# EAGLE design main (EAGLE 6.5.0)
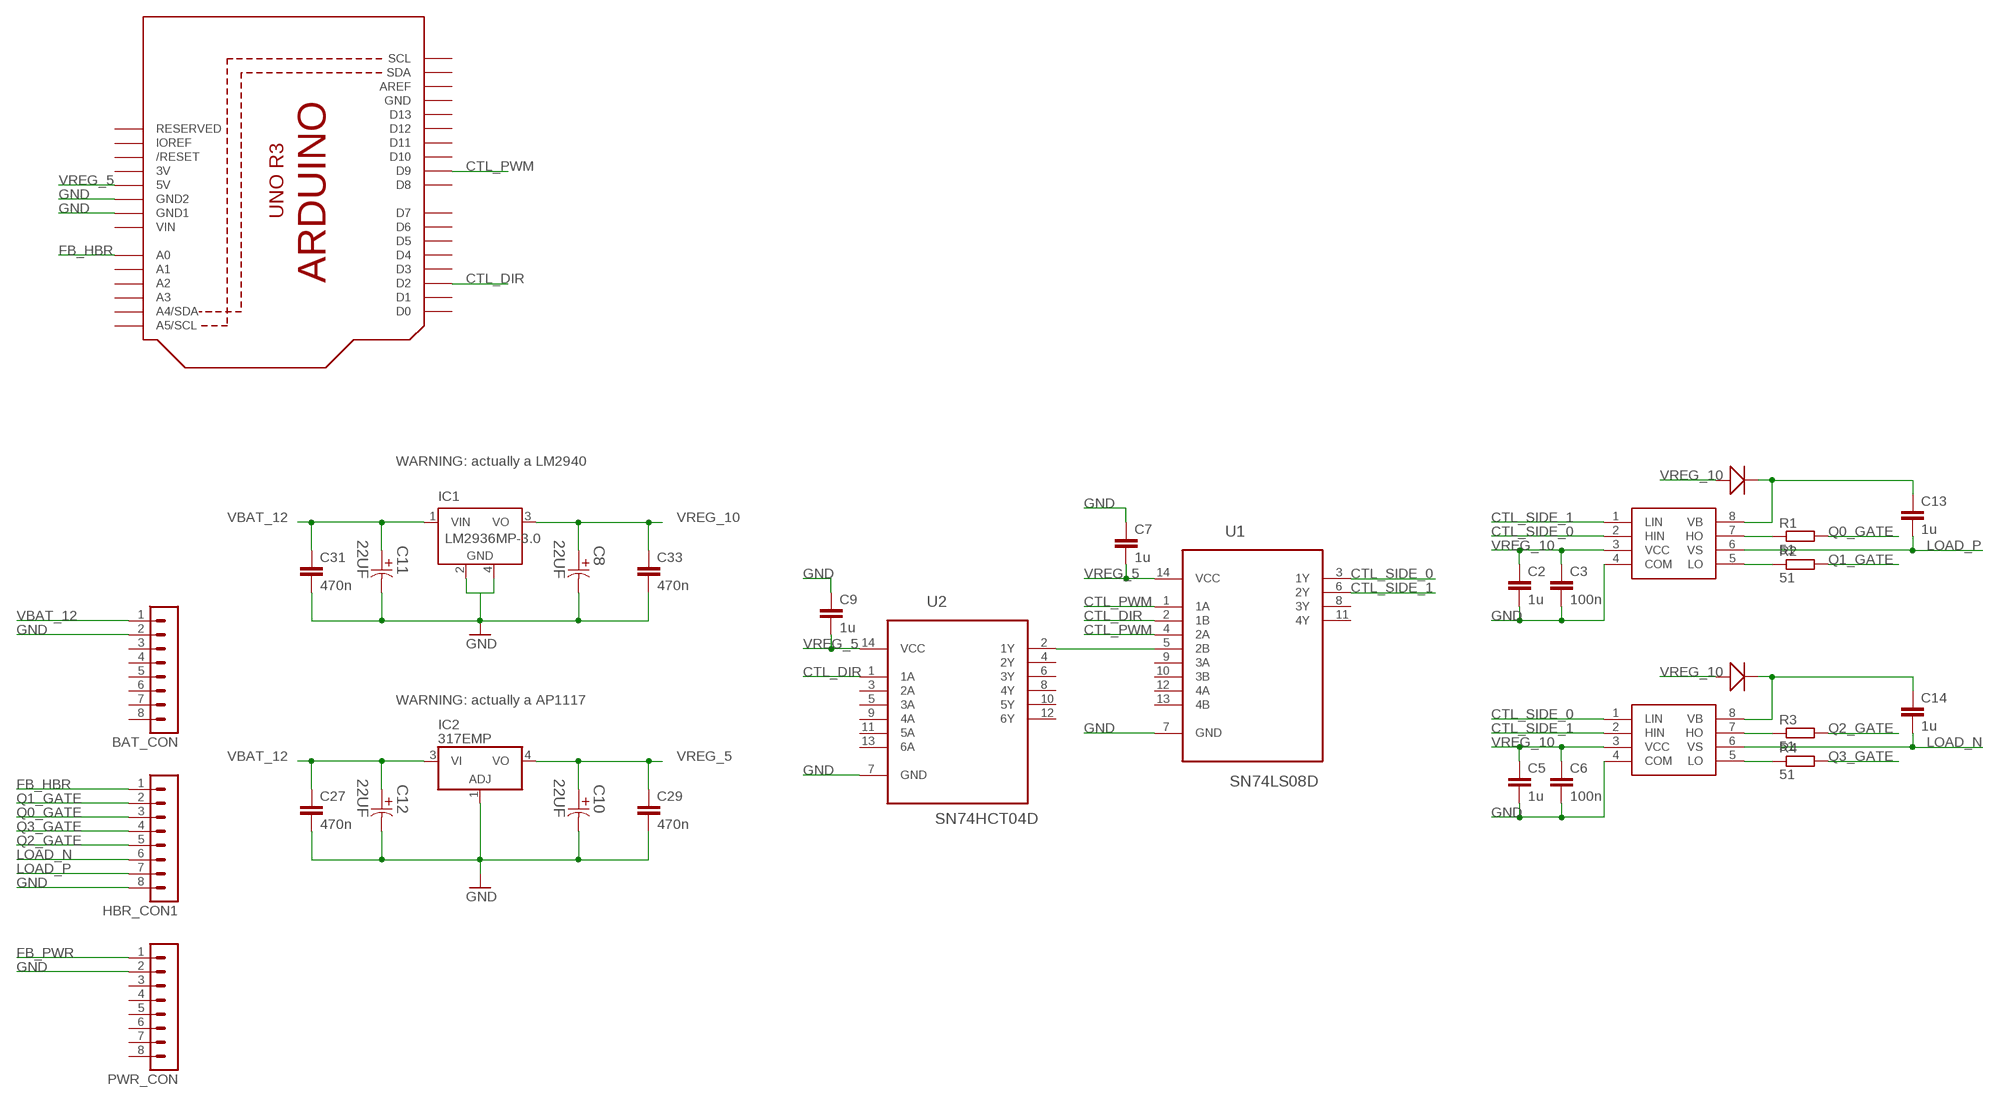
[diagram p0: schematic, sheet 1]

## Parts
BAT_CON  MA08-1  [MA08-1]
C2  1u  C-EUC1206  [C1206]
C3  100n  C-EUC1206  [C1206]
C5  1u  C-EUC1206  [C1206]
C6  100n  C-EUC1206  [C1206]
C7  1u  C-EUC1206  [C1206]
C8  22UF  EEE-1EA220SP-CASE-D  [CAPAE660X610N]
C9  1u  C-EUC1206  [C1206]
C10  22UF  EEE-1EA220SP-CASE-D  [CAPAE660X610N]
C11  22UF  EEE-1EA220SP-CASE-D  [CAPAE660X610N]
C12  22UF  EEE-1EA220SP-CASE-D  [CAPAE660X610N]
C13  1u  C-EUC2220K  [C2220K]
C14  1u  C-EUC2220K  [C2220K]
C27  470n  C-EUC1206  [C1206]
C29  470n  C-EUC1206  [C1206]
C31  470n  C-EUC1206  [C1206]
C33  470n  C-EUC1206  [C1206]
HBR_CON1  MA08-1  [MA08-1]
IC1  LM2936MP-3.0  [SOT223]
IC2  317EMP  [SOT223]
IR2304_0  IR2304  [SOIC8]
IR2304_1  IR2304  [SOIC8]
PWR_CON  MA08-1  [MA08-1]
R1  51  R-EU_M1206  [M1206]
R2  51  R-EU_M1206  [M1206]
R3  51  R-EU_M1206  [M1206]
R4  51  R-EU_M1206  [M1206]
U1  SN74LS08D  [SOIC127P600X175-14N]
U2  SN74HCT04D  [SOIC127P600X175-14N]
U3  ARDUINOR3-DIMENSION  [ARDUINOR3]
U$1  1SR154  [SOD106-W]
U$2  1SR154  [SOD106-W]

## Nets
CTL_DIR: U1.2(1B) U2.1(1A) U3.D2
CTL_PWM: U1.1(1A) U1.4(2A) U3.D9
CTL_SIDE_0: IR2304_0.2(HIN) IR2304_1.1(LIN) U1.3(1Y)
CTL_SIDE_1: IR2304_0.1(LIN) IR2304_1.2(HIN) U1.6(2Y)
FB_HBR: HBR_CON1.1 U3.A0
FB_PWR: PWR_CON.1
GND: BAT_CON.2 C2.2 C3.2 C5.2 C6.2 C7.1 C8.2 C9.1 C10.2 C11.2 C12.2 C27.2 C29.2 C31.2 C33.2 HBR_CON1.8 IC2.1(ADJ) IR2304_0.4(COM) IR2304_1.4(COM) PWR_CON.2 U1.7(GND) U2.7(GND) U3.GND1 U3.GND2
LOAD_N: C14.2 HBR_CON1.6 IR2304_1.6(VS)
LOAD_P: C13.2 HBR_CON1.7 IR2304_0.6(VS)
N$1: C13.1 IR2304_0.8(VB) U$1.C
N$2: C14.1 IR2304_1.8(VB) U$2.C
N$3: IR2304_0.7(HO) R1.1
N$4: IR2304_0.5(LO) R2.1
N$5: U1.5(2B) U2.2(1Y)
N$6: IR2304_1.7(HO) R3.1
N$7: IR2304_1.5(LO) R4.1
N$8: IC1.2(GND) IC1.4(GND)
Q0_GATE: HBR_CON1.3 R1.2
Q1_GATE: HBR_CON1.2 R2.2
Q2_GATE: HBR_CON1.5 R3.2
Q3_GATE: HBR_CON1.4 R4.2
VBAT_12: BAT_CON.1 C11.1 C12.1 C27.1 C31.1 IC1.1(VIN) IC2.3(VI)
VREG_5: C7.2 C9.2 C10.1 C29.1 IC2.4(VO) U1.14(VCC) U2.14(VCC) U3.5V
VREG_10: C2.1 C3.1 C5.1 C6.1 C8.1 C33.1 IC1.3(VO) IR2304_0.3(VCC) IR2304_1.3(VCC) U$1.A U$2.A
Unconnected: BAT_CON.3 BAT_CON.4 BAT_CON.5 BAT_CON.6 BAT_CON.7 BAT_CON.8 PWR_CON.3 PWR_CON.4 PWR_CON.5 PWR_CON.6 PWR_CON.7 PWR_CON.8 U1.8(3Y) U1.9(3A) U1.10(3B) U1.11(4Y) U1.12(4A) U1.13(4B) U2.3(2A) U2.4(2Y) U2.5(3A) U2.6(3Y) U2.8(4Y) U2.9(4A) U2.10(5Y) U2.11(5A) U2.12(6Y) U2.13(6A) U3.A1 U3.A2 U3.A3 U3.A4(A4/SDA) U3.A5(A5/SCL) U3.AREF U3.D0 U3.D1 U3.D3 U3.D4 U3.D5 U3.D6 U3.D7 U3.D8 U3.D10 U3.D11 U3.D12 U3.D13 U3.IOREF U3.RESERVED U3.RESET(/RESET) U3.SCL U3.SDA

## Notes on the sheet
- WARNING: actually a LM2940
- WARNING: actually a AP1117

## Power pins joined to a net without a drawn wire
3V: U3.3V
GND: U3.GND
VIN: U3.VIN

## Library data of the parts
BAT_CON HBR_CON1 PWR_CON = con-lstb:MA08-1: PIN HEADER; OC_FARNELL: unknown; OC_NEWARK: unknown
C2 C3 C5-C7 C9 C13 C14 C27 C29 C31 C33 = rcl:C-EU: CAPACITOR, European symbol
C8 C10-C12 = Panasonic-EEE0_EEE1_EEE2_EEEFC:EEE-: Aluminum Electrolytic Capacitors,Surface Mount Type; MPN: EEE-1EA220SP; OC_FARNELL: 9696970; OC_NEWARK: 96K9430; PACKAGE: CASE-D; SUPPLIER: PANASONIC; TOLERANCE: 20%; VOLTAGERATING: 25V
IC1 = national-semiconductor:LM2936MP?*: Ultra-Low Quiescent Current LDO Voltage Regulator Source: Data sheet <http://www.national.com/ds/LM/LM2936.pdf>; MF: NATIONAL SEMICONDUCTOR; MPN: LM2936MP-3.0/NOPB; OC_FARNELL: 1496125; OC_NEWARK: 41K4522
IC2 = linear:*317: Positive VOLTAGE REGULATOR
IR2304_0 IR2304_1 = ir2304:IR2304
R1-R4 = rcl:R-EU_: RESISTOR, European symbol
U1 = sn74ls08d:SN74LS08D: QUADRUPLE 2-INPUT POSITIVE -AND GATES; MPN: SN74LS08D; OC_FARNELL: 1287549; OC_NEWARK: 08F6633; PACKAGE: SOIC-14; SUPPLIER: Texas Instruments
U2 = sn74hct04d:SN74HCT04D: HEX INVERTERS; MPN: SN74HCT04D; OC_FARNELL: 9591761; OC_NEWARK: 52F5557; PACKAGE: SOIC-14; SUPPLIER: Texas Instruments
U3 = adafruit:ARDUINOR3: This is a new object for the new Arduino R3 - with extra pins that you may want to use (such as IOref, and duplicated A4/A5
U$1 U$2 = 1sr154:1SR154

## Board
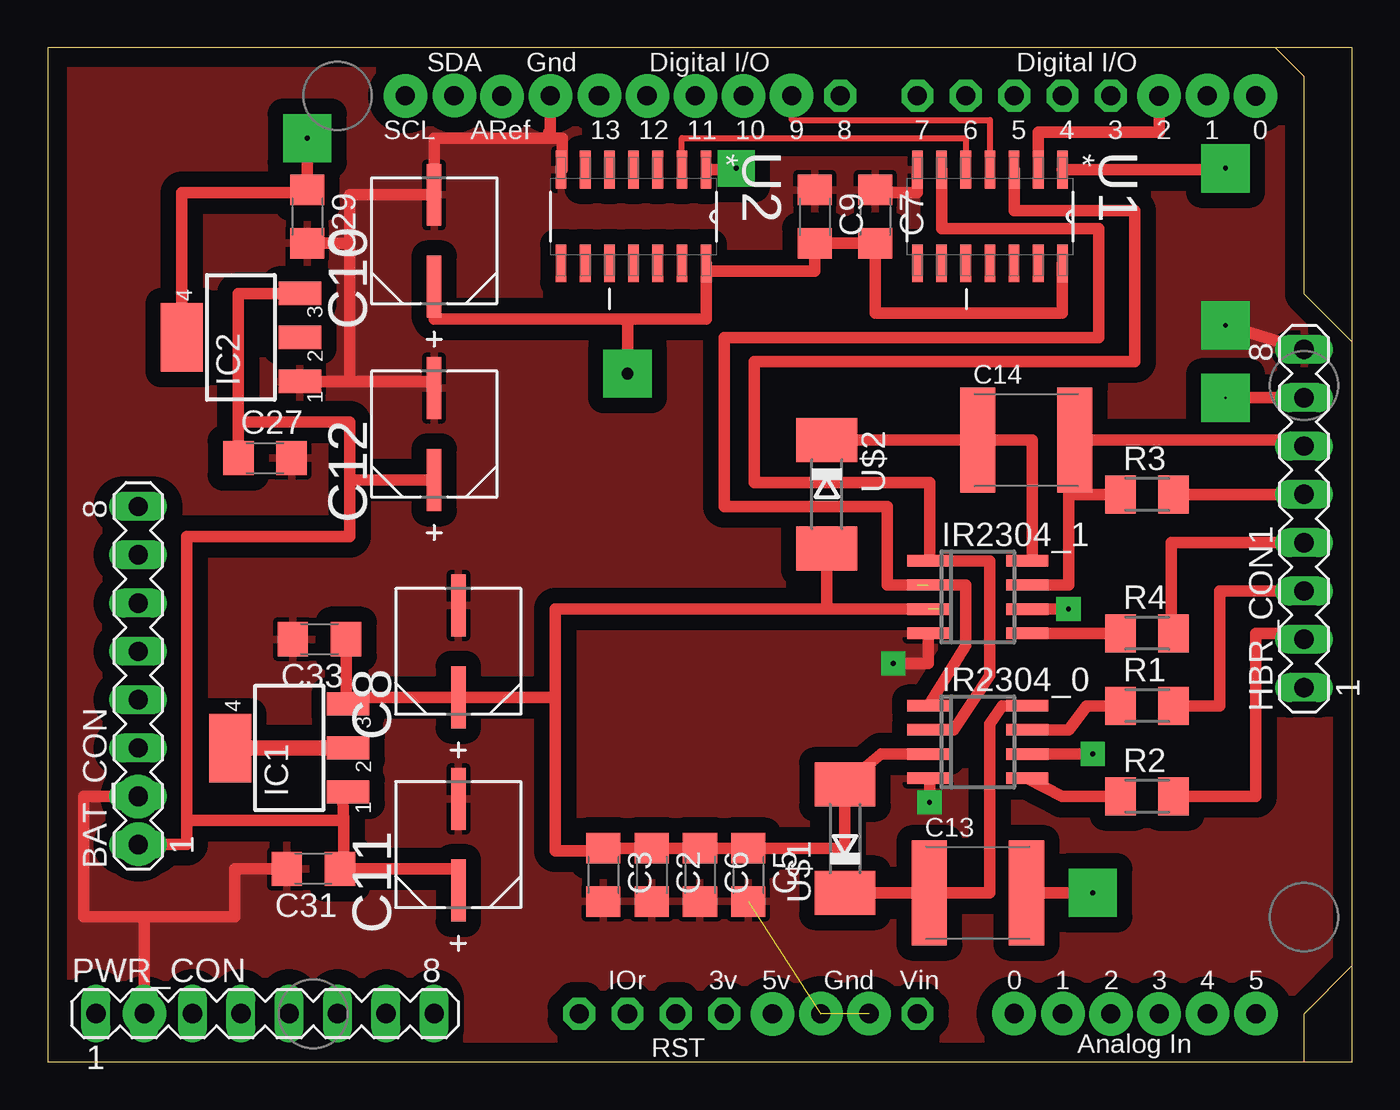
[diagram p1: board, top side]
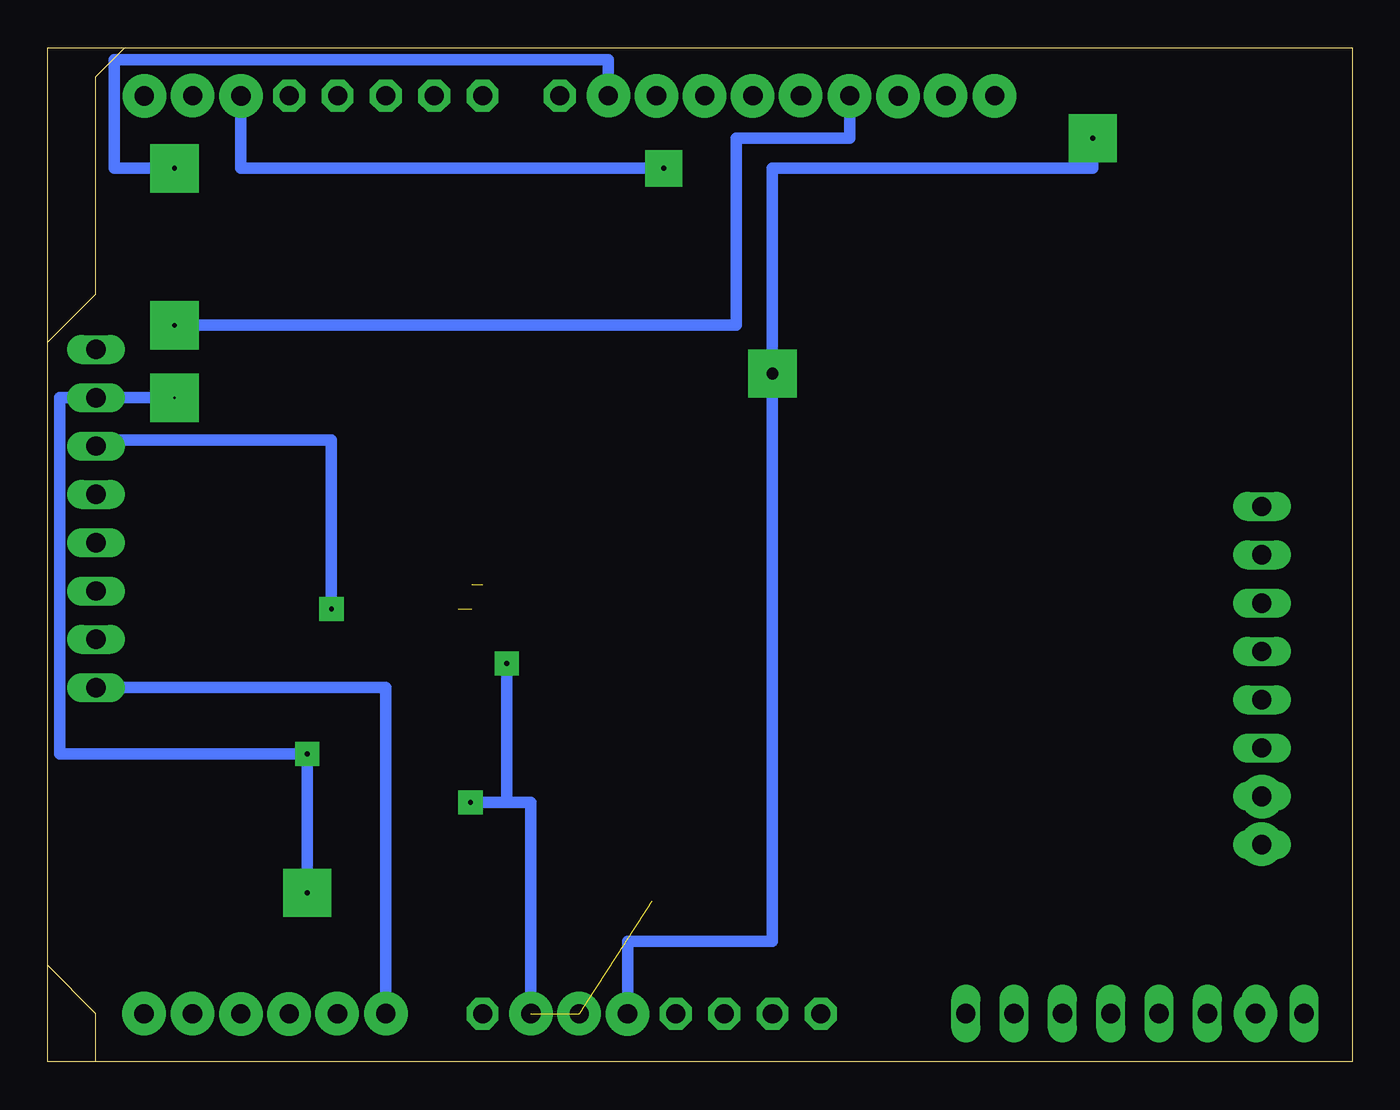
[diagram p2: board, bottom side, seen from below]

Size 68.58 x 53.34 mm. Coordinates in mm from the lower left corner, seen from the top.
Outline: 0,0 68.57,0 68.57,53.33 0,53.33 0,0
Copper layers (1*16): Top 0.035mm / dielectric 1.5mm / Bottom 0.035mm
Design rules "default": minimum track width 10mil, minimum drill 24mil, track to track 8mil, track to pad 8mil, pad to pad 8mil, via to via 8mil, smd to smd 8mil, copper to edge 40mil, drill to drill 8mil, minimum pad ring 10mil, minimum via ring 8mil, stop-mask expansion 4mil, vias tented up to drill 0mil, thermal gap 10mil

### Footprints (pad centres in the part's own frame; a part is rotated, then mirrored left to right if it is on the bottom)
MA08-1 = drill 1.016 long: 1 -8.89,0; 2 -6.35,0; 3 -3.81,0; 4 -1.27,0; 5 1.27,0; 6 3.81,0; 7 6.35,0; 8 8.89,0
C1206 = smd 1.6 x 1.8: 1 -1.4,0; 2 1.4,0
CAPAE660X610N = smd 3.251 x 0.762: 1 -2.413,0; 2 2.413,0
C2220K = smd 1.85 x 5.5: 1 -2.55,0; 2 2.55,0
SOT223 = smd 1.219 x 2.235: 1 -2.311,-3.099; 2 0,-3.099; 3 2.311,-3.099 | smd 3.6 x 2.2: 4 0,3.099
SOIC8 = smd 0.6 x 2.2: 1 -1.905,-2.6; 2 -0.635,-2.6; 3 0.635,-2.6; 4 1.905,-2.6; 5 1.905,2.6; 6 0.635,2.6; 7 -0.635,2.6; 8 -1.905,2.6
M1206 = smd 1.6 x 2: 1 -1.4,0; 2 1.4,0
SOIC127P600X175-14N = smd 1.981 x 0.559: 1 -2.464,3.81; 2 -2.464,2.54; 3 -2.464,1.27; 4 -2.464,0; 5 -2.464,-1.27; 6 -2.464,-2.54; 7 -2.464,-3.81; 8 2.464,-3.81; 9 2.464,-2.54; 10 2.464,-1.27; 11 2.464,0; 12 2.464,1.27; 13 2.464,2.54; 14 2.464,3.81
ARDUINOR3 = drill 1 pad 1.676 octagon: 3V 35.56,2.54; 5V 38.1,2.54; A0 50.8,2.54; A1 53.34,2.54; A2 55.88,2.54; A3 58.42,2.54; A4 60.96,2.54; A5 63.5,2.54; AREF 23.876,50.8; D0 63.5,50.8; D1 60.96,50.8; D2 58.42,50.8; D3 55.88,50.8; D4 53.34,50.8; D5 50.8,50.8; D6 48.26,50.8; D7 45.72,50.8; D8 41.656,50.8; D9 39.116,50.8; D10 36.576,50.8; D11 34.036,50.8; D12 31.496,50.8; D13 28.956,50.8; GND 26.416,50.8; GND1 43.18,2.54; GND2 40.64,2.54; IOREF 30.48,2.54; RESERVED 27.94,2.54; RESET 33.02,2.54; SCL 18.796,50.8; SDA 21.336,50.8; VIN 45.72,2.54
SOD106-W = smd 2.3 x 3.2: A 2.85,0; C -2.85,0

### Placement (x,y rotation side)
BAT_CON  4.76,20.32 90 top
C2  31.75,9.84 270 top
C3  29.21,9.84 270 top
C5  36.83,9.84 270 top
C6  34.29,9.84 270 top
C7  43.5,44.45 270 top
C8  21.59,21.59 90 top
C9  40.32,44.45 270 top
C10  20.32,43.18 90 top
C11  21.59,11.43 90 top
C12  20.32,33.02 90 top
C13  48.9,8.89 0 top
C14  51.44,32.7 0 top
C27  11.43,31.75 0 top
C29  13.65,44.45 270 top
C31  13.97,10.16 180 top
C33  14.29,22.23 180 top
HBR_CON1  66.04,28.57 90 top
IC1  12.7,16.51 90 top
IC2  10.16,38.1 90 top
IR2304_0  48.9,16.83 270 top
IR2304_1  48.9,24.45 270 top
PWR_CON  11.43,2.54 0 top
R1  57.78,18.73 0 top
R2  57.78,13.97 0 top
R3  57.78,29.84 0 top
R4  57.78,22.54 0 top
U1  49.53,44.45 270 top
U2  30.8,44.45 270 top
U3  0,0 0 top
U$1  41.91,11.75 90 top
U$2  40.96,29.84 270 top

### Tracks (layer width: path | path; a pad name or v marks a point on that pad's centre or on a via)
CTL_DIR  (via drill 0.25 pad 1.93)
  Top 0.61: U1.2 52.07,48.9 58.42,48.9 U3.D2 | U2.1 36.2,46.91 v36.2,46.99
  Bottom 0.61: v36.2,46.99 58.42,46.99 U3.D2
CTL_PWM  (via drill 0.25 pad 2.54)
  Top 0.305: U1.4 49.53,49.53 39.12,49.53 U3.D9
  Top 0.61: U1.1 61.59,46.91 v61.91,46.99
  Bottom 0.61: v61.91,46.99 65.09,46.99 65.09,52.7 39.12,52.7 U3.D9
CTL_SIDE_0
  Top 0.305: IR2304_0.2 47.62,17.46
  Top 0.406: 46.35,26.35 IR2304_1.1
  Top 0.61: 47.62,17.46 49.53,20.32 49.53,26.35 46.35,26.35 46.35,30.48 37.15,30.48 37.15,36.83 57.15,36.83 57.15,44.77 50.8,44.77 U1.3
CTL_SIDE_1  (1 unrouted)
  Top 0.61: IR2304_1.2 48.26,25.08 48.26,21.91 IR2304_0.1 | U1.6 46.99,43.81 55.24,43.81 55.24,38.1 35.56,38.1 35.56,29.21 44.13,29.21 44.13,25.08 45.72,25.08
FB_HBR
  Bottom 0.61: HBR_CON1.1 50.8,19.68 U3.A0
GND  (via drill 0.25 pad 1.27, 0.25 pad 2.54)  (2 unrouted)
  Top 0.61: U2.7 27.05,46.91 27.05,48.58 26.35,48.58 | U1.7 45.72,45.72 43.18,45.72 C7.1 | C31.2 9.84,10.16 9.84,7.62 5.08,7.62 | 5.08,7.62 PWR_CON.2 | BAT_CON.2 1.91,13.97 1.91,7.62 5.08,7.62 | IC2.1 15.88,35.79 | 15.88,35.79 20.32,35.79 C12.2 | C29.2 15.88,43.05 | 15.88,43.05 15.88,35.79 | 26.35,48.58 20.32,48.58 C10.2 15.88,45.59 15.88,43.05 | IR2304_0.4 46.35,14.92 v46.35,13.65 | v44.45,20.95 46.3,20.95 IR2304_1.4 | HBR_CON1.8 v61.91,38.73 | U3.GND 26.42,48.9 26.35,48.9 26.35,48.58
  Bottom 0.61: U3.GND 26.42,48.58 32.38,48.58 32.38,38.73 v61.91,38.73 | v46.35,13.65 44.45,13.65 | 44.45,13.65 v44.45,20.95 | 44.45,13.65 43.18,13.65 U3.GND1
  pour Top (isolate 0.813): 0,53.34 68.58,53.34 68.58,0 0,0
LOAD_N  (via drill 0.25 pad 1.27)
  Top 0.254: 66.04,32.7 HBR_CON1.6
  Top 0.61: C14.2 66.04,32.7 | IR2304_1.6 v53.66,23.81
  Bottom 0.61: v53.66,23.81 53.66,32.7 66.04,32.7 HBR_CON1.6
LOAD_P  (via drill 0.13 pad 2.54, 0.25 pad 1.27, 0.25 pad 2.54)
  Top 0.61: HBR_CON1.7 v61.91,34.92 | v54.93,16.19 IR2304_0.6 | C13.2 v54.93,8.89
  Bottom 0.61: v61.91,34.92 67.94,34.92 67.94,16.19 v54.93,16.19 v54.93,8.89
N$1
  Top 0.61: U$1.C C13.1 49.53,8.89 49.53,17.78 50.16,18.73 IR2304_0.8
N$2
  Top 0.61: U$2.C 46.34,32.7 C14.1 51.75,32.7 51.75,26.35 IR2304_1.8
N$3
  Top 0.61: IR2304_0.7 53.66,17.46 54.61,18.73 R1.1
N$4
  Top 0.61: IR2304_0.5 53.34,13.97 R2.1
N$5
  Top 0.305: U2.2 33.34,48.58 48.26,48.58 U1.5
N$6
  Top 0.61: R3.1 53.66,29.84 53.66,25.08 IR2304_1.7
N$7
  Top 0.61: IR2304_1.5 R4.1
N$8
  Top 0.813: IC1.2 IC1.4
N$9  (via drill 1 pad 2.29)
  other vias: 18.8,50.8
N$10  (via drill 1 pad 2.29)
  other vias: 21.38,50.82
N$11  (via drill 1 pad 2.29)
  other vias: 23.88,50.78
N$12  (via drill 1 pad 2.29)
  other vias: 26.42,50.8
N$13  (via drill 1 pad 2.29)
  other vias: 29.02,50.82
N$14  (via drill 1 pad 2.29)
  other vias: 31.52,50.8
N$15  (via drill 1 pad 2.29)
  other vias: 34.04,50.8
N$16  (via drill 1 pad 2.29)
  other vias: 36.58,50.8
N$17  (via drill 1 pad 2.29)
  other vias: 39.11,50.81
N$18  (via drill 1 pad 2.29)
  other vias: 58.41,50.79
N$19  (via drill 1 pad 2.29)
  other vias: 60.96,50.81
N$20  (via drill 1 pad 2.29)
  other vias: 63.49,50.79
N$21  (via drill 1 pad 2.29)
  other vias: 50.8,2.55
N$22  (via drill 1 pad 2.29)
  other vias: 53.36,2.54
N$23  (via drill 1 pad 2.29)
  other vias: 55.88,2.53
N$24  (via drill 1 pad 2.29)
  other vias: 58.41,2.53
N$25  (via drill 1 pad 2.29)
  other vias: 60.97,2.54
N$26  (via drill 1 pad 2.29)
  other vias: 63.52,2.54
N$27  (via drill 1 pad 2.29)
  other vias: 40.65,2.54
N$28  (via drill 1 pad 2.29)
  other vias: 43.17,2.55
N$29  (via drill 1 pad 2.29)
  other vias: 38.1,2.53
N$30  (via drill 1 pad 2.29)
  other vias: 5.1,2.55
N$31  (via drill 1 pad 2.29)
  other vias: 4.77,11.45
N$32  (via drill 1 pad 2.29)
  other vias: 4.76,13.94
Q0_GATE
  Top 0.61: R1.2 61.59,18.73 61.59,24.77 HBR_CON1.3
Q1_GATE
  Top 0.61: R2.2 63.5,13.97 63.5,22.54 66.04,22.54 HBR_CON1.2
Q2_GATE
  Top 0.61: R3.2 HBR_CON1.5
Q3_GATE
  Top 0.61: HBR_CON1.4 59.05,27.3 59.05,22.54 R4.2
VBAT_12
  Top 0.61: IC2.3 10.03,40.41 10.03,33.66 | 10.03,33.66 C27.1 | C12.1 15.88,30.61 | 15.88,30.61 15.88,33.66 10.03,33.66 | BAT_CON.1 7.3,11.43 7.3,12.7 | 7.3,12.7 15.56,12.7 | 15.56,12.7 15.48,14.29 IC1.1 | C11.1 21.59,10.16 C31.1 15.56,10.16 15.56,12.7 | 15.88,30.61 15.88,27.62 7.3,27.62 7.3,12.7
VREG_5  (via drill 0.25 pad 2.54, 0.61)
  Top 0.61: 34.61,41.59 40.32,41.59 C9.2 C7.2 43.5,39.37 53.34,39.37 U1.14 | IC2.4 7.06,45.72 13.65,45.72 C29.1 v13.65,48.58 | U2.14 34.61,41.59 | 34.61,41.59 34.61,39.05 30.48,39.05 | 30.48,39.05 20.32,39.05 C10.1 | v30.48,36.2 30.48,39.05
  Bottom 0.61: v13.65,48.58 13.65,46.99 30.48,46.99 v30.48,36.2 30.48,6.35 38.1,6.35 U3.5V
VREG_10  (1 unrouted)
  Top 0.61: 26.67,19.18 C8.1 15.69,19.18 | U$1.A | U$1.A 43.81,16.19 IR2304_0.3 | U$2.A 40.96,23.81 | 40.96,23.81 46.99,23.81 | 26.67,19.18 26.67,11.11 29.21,11.11 C3.1 C2.1 C6.1 C5.1 41.91,11.24 U$1.A | 40.96,23.81 26.67,23.81 26.67,19.18 | IC1.3 15.69,18.82 15.69,19.18 | 15.69,19.18 C33.1